# Altium schematic sheet power management.SchDoc: Power Management circuit
size A4; Revision: 1.0.0; SheetNumber: 3; SheetTotal: 3
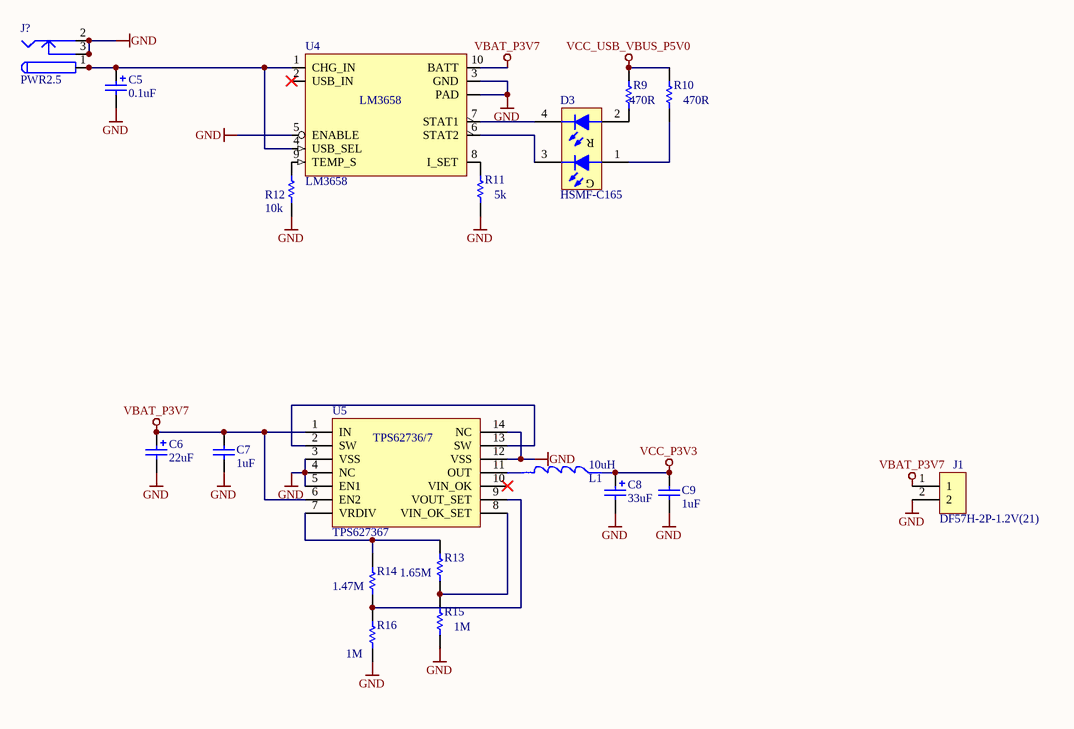
[diagram p0: power management.SchDoc]

## Parts
C5  value 0.1uF  [A]  (hidden comment: T491A104M035AT)
C6  value 22uF  [A]  (hidden comment: T491A226M010ZT)
C7  value 1uF  [1608[0603]]  (hidden comment: C0603C105K8PACTU)
C8  value 33uF  [A]  (hidden comment: T491A336K010AT)
C9  value 1uF  [1608[0603]]  (hidden comment: C0603C105K8PACTU)
D3  HSMF-C165  [1.6X0.8X0.5]
J1  DF57H-2P-1.2V(21)  [DF57H-2P-1.2V(21)]
J?  PWR2.5  [KLD-0202]
L1  value 10uH  [WE-TPC]  (hidden comment: 744029100)
R9  value 470R  [3-0603]  (hidden comment: ERJ-3GEYJ471V)
R10  value 470R  [3-0603]  (hidden comment: ERJ-3GEYJ471V)
R11  value 5k  [3-0603]  (hidden comment: ERJ-3GEYJ502V)
R12  value 10k  [3-0603]  (hidden comment: ERJ2GEJ103X)
R13  value 1.65M  [3-0603]  (hidden comment: CRCW06031M65FKEA)
R14  value 1.47M  [3-0603]  (hidden comment: CRCW06031M47FKEA)
R15  value 1M  [3-0603]  (hidden comment: ERJ-3GEYJ105V)
R16  value 1M  [3-0603]  (hidden comment: ERJ-3GEYJ105V)
U4  LM3658  [WSON10]
U5  TPS627367  [QFN50P350X350X100_HS-15N]

## Nets
GND: C5.2 C6.2 C7.2 C8.2 C9.2 J1.2 J?.2 J?.2A J?.2B J?.3 J?.3A J?.3B R11.1 R12.1 R15.1 R16.1 U4.3(GND) U4.5(ENABLE) U4.11(PAD) U5.3(VSS) U5.4(NC) U5.5(EN1) U5.12(VSS) U5.14(NC) U5.15(PAD)
VBAT_P3V7: C6.1 C7.1 J1.1 U4.10(BATT) U5.1(IN) U5.6(EN2)
VCC_P3V3: C8.1 C9.1 L1.2
VCC_USB_VBUS_P5V0: R9.2 R10.2
NetC5_1: C5.1 J?.1 J?.1A J?.1B U4.1(CHG_IN) U4.4(USB_SEL)
NetD3_1: D3.1(A1) R10.1
NetD3_2: D3.2(A2) R9.1
NetD3_3: D3.3(K1) U4.6(STAT2)
NetD3_4: D3.4(K2) U4.7(STAT1)
NetL1_1: L1.1 U5.11(OUT)
NetR11_2: R11.2 U4.8(I_SET)
NetR12_2: R12.2 U4.9(TEMP_S)
NetR13_1: R13.1 R15.2 U5.8(VIN_OK_SET)
NetR13_2: R13.2 R14.2 U5.7(VRDIV)
NetR14_1: R14.1 R16.2 U5.9(VOUT_SET)
NetU5_2: U5.2(SW) U5.13(SW)

Not connected (* = marked no-connect by the designer): U4 2(USB_IN)*; U5 10(VIN_OK)*

## Notes on the sheet
- Title
- Size:
- Date:
- A4
- Number:
- Time:
- Revision:
- Sheet
- of
- File:
- (in symbol HSMF-C165) R; G
- (in symbol TPS62737) TPS62736/7

## Library data of the parts
C5 = T491A: Tantalum Chip Capacitor, 0.1uF, 35V, 20%, package 1206,  T491 Series; Published: 17-Jul-2002; LatestRevisionDate: 19-Mar-2004; LatestRevisionNote: Silkscreen dimensions re-sized.; DatasheetDocument: Mar-2001; PackageDocument: Mar-2001; PackageReference: A; Publisher: Altium Limited; Code_JEITA: 3216-18; ComponentLink1Description: Manufacturer Link; ComponentLink1URL: http://www.kemet.com/; ComponentLink2Description: Datasheet; ComponentLink2URL: http://www.kemet.com/kemet/web/homepage/kechome.nsf/vapubfilesname/F3102TA.pdf/$file/F3102TA.pdf
C6 = T491A: Tantalum Chip Capacitor, 22uF, 10V, 20%, package 1206,  T491 Series; Published: 17-Jul-2002; LatestRevisionDate: 19-Mar-2004; LatestRevisionNote: Silkscreen dimensions re-sized.; DatasheetDocument: Mar-2001; PackageDocument: Mar-2001; PackageReference: A; Publisher: Altium Limited; Code_JEITA: 3216-18; ComponentLink1Description: Manufacturer Link; ComponentLink1URL: http://www.kemet.com/; ComponentLink2Description: Datasheet; ComponentLink2URL: http://www.kemet.com/kemet/web/homepage/kechome.nsf/vapubfilesname/F3102TA.pdf/$file/F3102TA.pdf
C7 C9 = C0603: Ceramic Chip Capacitor - Standard; Note: Footprint corresponds to dimensions for bulk cassette packaging. This case size has tightened tolerances.; Published: 17-Jul-2002; LatestRevisionDate: 19-Mar-2004; LatestRevisionNote: Silkscreen size reduced.; DatasheetDocument: Mar-2001; PackageDocument: Mar-2001; PackageReference: 0603; Publisher: Altium Limited; Code_JEITA: 0603; Code_IPC: 1608 [0603]; ComponentLink1Description: Manufacturer Link; ComponentLink1URL: http://www.kemet.com/; ComponentLink2Description: Datasheet; ComponentLink2URL: http://www.kemet.com/kemet/web/homepage/kechome.nsf/vapubfilesname/F3102TA.pdf/$file/F3102TA.pdf
C8 = T491A: Tantalum Chip Capacitor, 33uF, 10V, 20%, package 1206,  T491 Series; Published: 17-Jul-2002; LatestRevisionDate: 19-Mar-2004; LatestRevisionNote: Silkscreen dimensions re-sized.; DatasheetDocument: Mar-2001; PackageDocument: Mar-2001; PackageReference: A; Publisher: Altium Limited; Code_JEITA: 3216-18; ComponentLink1Description: Manufacturer Link; ComponentLink1URL: http://www.kemet.com/; ComponentLink2Description: Datasheet; ComponentLink2URL: http://www.kemet.com/kemet/web/homepage/kechome.nsf/vapubfilesname/F3102TA.pdf/$file/F3102TA.pdf
D3 = HSMF-C165: Miniature Bi-Colour Surface Mount Chip LED (Red/Green); LuminousIntensity: 2.5mcd (Minimum).; LED_Colour: Red & Green; PCB_Layout: Complies with manufacturer's recommendation.; Published: 11-Dec-2002; DatasheetVersion: 6-Apr-2002; PackageVersion: 6-Apr-2002; PackageReference: 1.6X0.8X0.5; Publisher: Altium Limited; PackageDescription: SM LED, Bi-Colour; 4 Flat Leads; Body 1.6 x 0.8 x 0.5 mm (LxWxH); ComponentLink1Description: Manufacturer Link; ComponentLink1URL: http://www.avagotech.com/; ComponentLink2Description: Datasheet; ComponentLink2URL: http://cp.literature.agilent.com/litweb/pdf/5988-6146EN.pdf
J1 = DF57H-2P-1.2V(21): low profile connector, 1.2mm pitch, SMD, 2 pin
J? = PWR2.5: Low Voltage Power Supply Connector; Published: 17-Dec-2003; DatasheetDocument: 09-May-2002; Publisher: Altium Limited; ComponentLink1Description: Manufacturer Link; ComponentLink1URL: http://domino.kycon.com/internet/Products.html
L1 = 744029100: SMD power inductor, 10uH, .75A
R9-R11 R13-R16 = ERJ3EK: Precision Thick Film Chip Resistor, 10 Ohm to 1M Ohm Range, 1% and 0.5% Tolerance, 0603 Size, 0.063 W; Published: 17-Dec-2003; LatestRevisionDate: 19-Mar-2004; LatestRevisionNote: Silkscreen size reduced.; PackageDocument: Mar-2003; PackageReference: 3-0603; Publisher: Altium Limited; Code_IPC: 1608 [0603]; ComponentLink1Description: Manufacturer Link; ComponentLink1URL: http://www.panasonic.com/industrial/components/resistive_products.htm; ComponentLink2Description: Datasheet; ComponentLink2URL: http://www.panasonic.com/industrial/components/pdf/AOA0000CE2.pdf
R12 = ERJ2GE: Thick Film Chip Resistor, 10k Ohm Range, 5% Tolerance, 0402 Size, 0.063 W; Note: If flow soldering, adjust pad width of PCB Footprint to 0.7 - 0.8 times the width of the resistor.; Published: 17-Dec-2003; LatestRevisionDate: 19-Mar-2004; LatestRevisionNote: Silkscreen size reduced.; PackageDocument: Mar-2003; PackageReference: 2-0402; Publisher: Altium Limited; Code_IPC: 1005 [0402]; ComponentLink1Description: Manufacturer Link; ComponentLink1URL: http://www.panasonic.com/industrial/components/resistive_products.htm; ComponentLink2Description: Datasheet; ComponentLink2URL: http://www.panasonic.com/industrial/components/pdf/AOA0000CE1.pdf
U4 = LM3658: Dual Source USB/AC Li Chemistry Charger IC
U5 = TPS62737: ultra-low power buck converter, 50/200mA, enable pin